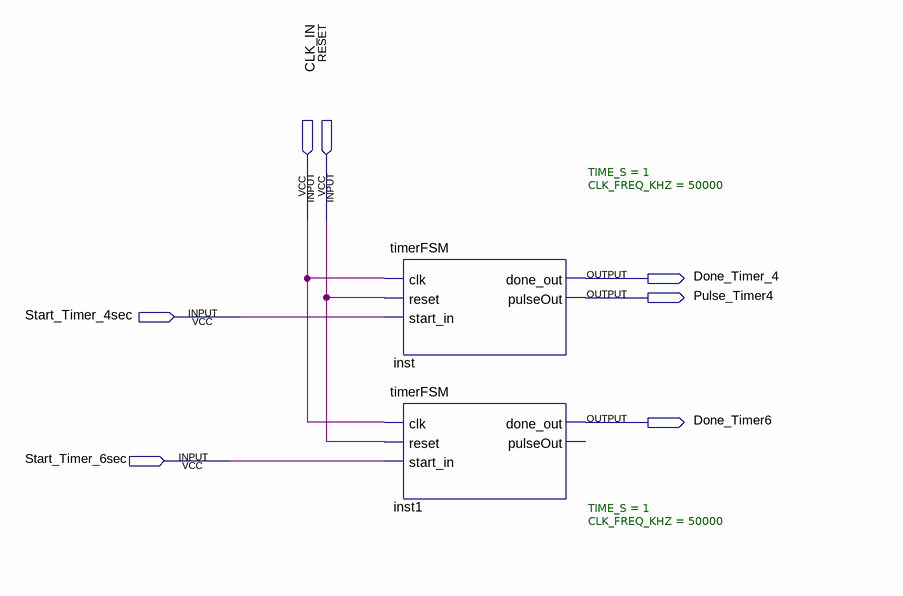
[diagram p0: schematic sheet]
// Quartus schematic Timer_Symbol.bdf as structural Verilog: 2 symbols, 7 pins
module Timer_Symbol (
  input  CLK_IN,
  input  RESET,
  input  Start_Timer_4sec,
  input  Start_Timer_6sec,
  output Done_Timer_4,
  output Pulse_Timer4,
  output Done_Timer6
);

  timerFSM #(.TIME_S(1), .CLK_FREQ_KHZ(50000)) inst (
    .clk(CLK_IN), .reset(RESET), .start_in(Start_Timer_4sec), .done_out(Done_Timer_4), .pulseOut(Pulse_Timer4));
  timerFSM #(.TIME_S(1), .CLK_FREQ_KHZ(50000)) inst1 (
    .clk(CLK_IN), .reset(RESET), .start_in(Start_Timer_6sec), .done_out(Done_Timer6));  // open: pulseOut
endmodule
